# Altium schematic sheet DAC.SchDoc
size A4; SheetNumber: 7; SheetTotal: 8
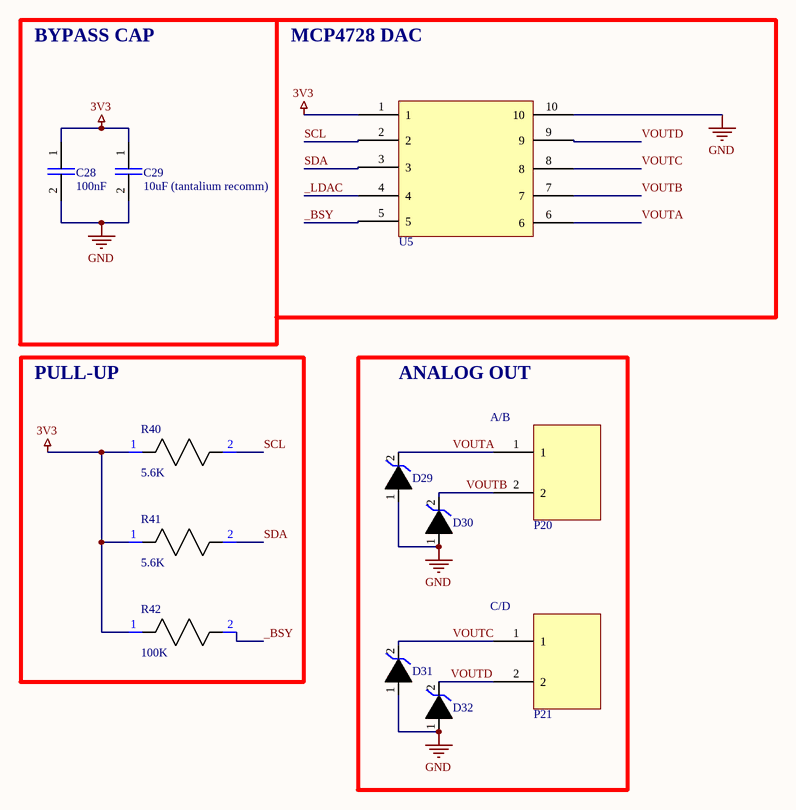
[diagram p0: DAC.SchDoc]

## Parts
C28  value 100nF  [0603 Cap]  (hidden comment: 0603 Capacitor)
C29  value 10uF (tantalium recomm)  [0603 Cap]  (hidden comment: 0603 Capacitor)
D29  TVS  [0805 TVS DIODE]  (value not drawn)
D30  TVS  [0805 TVS DIODE]  (value not drawn)
D31  TVS  [0805 TVS DIODE]  (value not drawn)
D32  TVS  [0805 TVS DIODE]  (value not drawn)
P20  A/B  [WR-TBL 322 2H]
P21  C/D  [WR-TBL 322 2H]
R40  value 5.6K  [0603 RES]  (hidden comment: Resistor)
R41  value 5.6K  [0603 RES]  (hidden comment: Resistor)
R42  value 100K  [0603 RES]  (hidden comment: Resistor)
U5  MCP4728  [10-PIN MSOP]  (value not drawn)

## Blocks framed on the sheet
BYPASS CAP: C28 C29
MCP4728 DAC: U5
PULL-UP: R40-R42
ANALOG OUT: D29-D32 P20 P21

## Nets
3V3: C28.1 C29.1 R40.1 R41.1 R42.1 U5.1
GND: C28.2 C29.2 D29.1 D30.1 D31.1 D32.1 U5.10
_BSY: R42.2 U5.5
_LDAC: U5.4
SCL: R40.2 U5.2
SDA: R41.2 U5.3
VOUTA: D29.2 P20.1 U5.6
VOUTB: D30.2 P20.2 U5.7
VOUTC: D31.2 P21.1 U5.8
VOUTD: D32.2 P21.2 U5.9

## Library data of the parts
C28 C29 = 0603 Cap: SMD 0603 (ceramic) capacitor; Manufacturer: Murata; Manufacturer Part Number: GRM21BR71C225KA12L; Multilayer: Yes; Tolerance  (fill in as +-): 10%; Rated DC Voltage (URdc): 16V; Temperature Characteristics Code: X7R; Supplier: Mouser; Supplier Part Number: 81-GRM21BR71C225KA2L; RoHS: Yes; Category: Ceramic Capacitors; Stock: 30148; Pricing: 1=0,3, 10=0,163, 50=0,163, 100=0,098, 1000=0,07, 10000=0,054 (USD); Mounting Technology: Surface Mount; Pins: 2; Package Shape: Rectangular; Terminal Finish: Nickel; Dielectric Material: Ceramic; Case/Package: 0805; Min Operating Temperature: -55°C; Max Operating Temperature: 125°C; JESD-609 Code: e3; Package Style: SMTMeter; Capacitor Type: Ceramic; Packaging: Tape and Reel; Tolerance (fill in as +-): 10%; Termination: Wraparound; Length: 2mm; Width: 1.25mm; Height: 1.25mm; Reach SVHC Compliant: Yes; RoHS Compliant: Yes; ComponentLink1URL: https://datasheet.ciiva.com:443/pdfs/VipMasterIC/IC/MURE/MURE-S-A0004349797/MURE-S-A0004361718-1.pdf?src-supplier=IHS+Markit; ComponentLink1Description: https://datasheet.ciiva.com:443/pdfs/VipMasterIC/IC/MURE/MURE-S-A0004349797/MURE-S-A0004361718-1.pdf?src-supplier=IHS+Markit; ComponentLink2URL: https://datasheet.ciiva.com/7937/608985-7937701.pdf?src-supplier=Element14; ComponentLink2Description: https://datasheet.ciiva.com/7937/608985-7937701.pdf?src-supplier=Element14
D29-D32 = TVS Diode: Schematic for TVS diode
P20 P21 = 322-2H: 322 series 2 pin header
R40-R42 = 0603 Res: Can be used for SMD resistors
U5 = 10-PIN MSOP